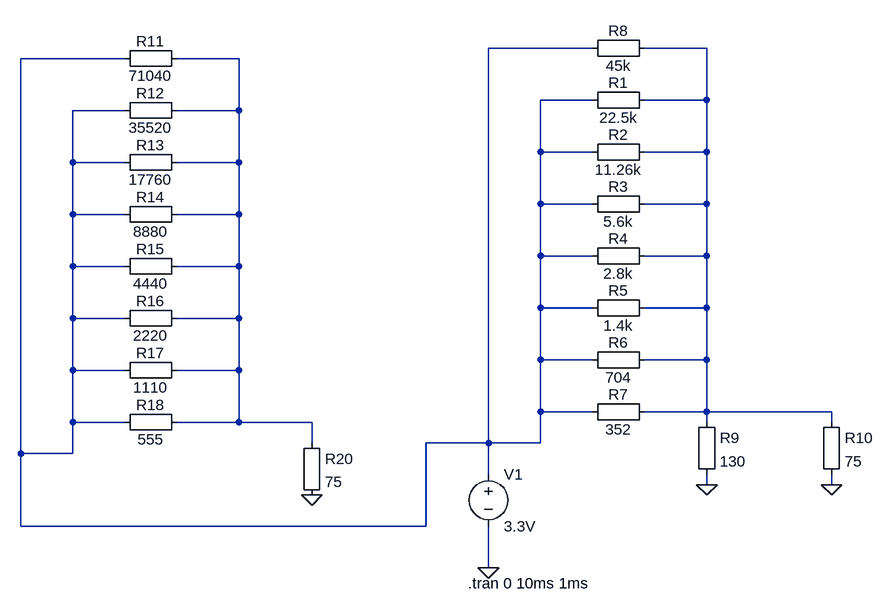
[diagram p0: schematic VGA_Widerstände.asc]
VGA_Widerstände.asc, the LTspice schematic file:
Version 4
SHEET 1 880 904
WIRE 128 64 -32 64
WIRE 304 64 208 64
WIRE -592 80 -752 80
WIRE -416 80 -512 80
WIRE 128 144 48 144
WIRE 304 144 304 64
WIRE 304 144 208 144
WIRE -592 160 -672 160
WIRE -416 160 -416 80
WIRE -416 160 -512 160
WIRE 48 224 48 144
WIRE 128 224 48 224
WIRE 304 224 304 144
WIRE 304 224 208 224
WIRE -672 240 -672 160
WIRE -592 240 -672 240
WIRE -416 240 -416 160
WIRE -416 240 -512 240
WIRE 48 304 48 224
WIRE 128 304 48 304
WIRE 304 304 304 224
WIRE 304 304 208 304
WIRE -672 320 -672 240
WIRE -592 320 -672 320
WIRE -416 320 -416 240
WIRE -416 320 -512 320
WIRE 48 384 48 304
WIRE 128 384 48 384
WIRE 304 384 304 304
WIRE 304 384 208 384
WIRE -672 400 -672 320
WIRE -592 400 -672 400
WIRE -416 400 -416 320
WIRE -416 400 -512 400
WIRE 48 464 48 384
WIRE 128 464 48 464
WIRE 304 464 304 384
WIRE 304 464 208 464
WIRE -672 480 -672 400
WIRE -592 480 -672 480
WIRE -416 480 -416 400
WIRE -416 480 -512 480
WIRE 48 544 48 464
WIRE 128 544 48 544
WIRE 304 544 304 464
WIRE 304 544 208 544
WIRE -672 560 -672 480
WIRE -592 560 -672 560
WIRE -416 560 -416 480
WIRE -416 560 -512 560
WIRE 48 624 48 544
WIRE 128 624 48 624
WIRE 304 624 304 544
WIRE 304 624 208 624
WIRE 496 624 304 624
WIRE -672 640 -672 560
WIRE -592 640 -672 640
WIRE -416 640 -416 560
WIRE -416 640 -512 640
WIRE -304 640 -416 640
WIRE 304 640 304 624
WIRE 496 640 496 624
WIRE -304 672 -304 640
WIRE -32 672 -32 64
WIRE -32 672 -128 672
WIRE 48 672 48 624
WIRE 48 672 -32 672
WIRE -752 688 -752 80
WIRE -672 688 -672 640
WIRE -672 688 -752 688
WIRE -32 720 -32 672
WIRE 304 736 304 720
WIRE 496 736 496 720
WIRE -752 800 -752 688
WIRE -128 800 -128 672
WIRE -128 800 -752 800
WIRE -32 864 -32 800
FLAG 304 736 0
FLAG -32 864 0
FLAG 496 736 0
FLAG -304 752 0
SYMBOL Misc\\EuropeanResistor 224 128 R90
WINDOW 0 5 56 VBottom 2
WINDOW 3 27 56 VTop 2
SYMATTR InstName R1
SYMATTR Value 22.5k
SYMBOL Misc\\EuropeanResistor 224 208 R90
WINDOW 0 5 56 VBottom 2
WINDOW 3 27 56 VTop 2
SYMATTR InstName R2
SYMATTR Value 11.26k
SYMBOL Misc\\EuropeanResistor 224 288 R90
WINDOW 0 5 56 VBottom 2
WINDOW 3 27 56 VTop 2
SYMATTR InstName R3
SYMATTR Value 5.6k
SYMBOL Misc\\EuropeanResistor 224 368 R90
WINDOW 0 5 56 VBottom 2
WINDOW 3 27 56 VTop 2
SYMATTR InstName R4
SYMATTR Value 2.8k
SYMBOL Misc\\EuropeanResistor 224 448 R90
WINDOW 0 5 56 VBottom 2
WINDOW 3 27 56 VTop 2
SYMATTR InstName R5
SYMATTR Value 1.4k
SYMBOL Misc\\EuropeanResistor 224 528 R90
WINDOW 0 5 56 VBottom 2
WINDOW 3 27 56 VTop 2
SYMATTR InstName R6
SYMATTR Value 704
SYMBOL Misc\\EuropeanResistor 224 608 R90
WINDOW 0 5 56 VBottom 2
WINDOW 3 27 56 VTop 2
SYMATTR InstName R7
SYMATTR Value 352
SYMBOL Misc\\EuropeanResistor 224 48 R90
WINDOW 0 5 56 VBottom 2
WINDOW 3 27 56 VTop 2
SYMATTR InstName R8
SYMATTR Value 45k
SYMBOL Misc\\EuropeanResistor 288 624 R0
SYMATTR InstName R9
SYMATTR Value 130
SYMBOL voltage -32 704 R0
WINDOW 123 0 0 Left 2
WINDOW 39 0 0 Left 2
SYMATTR InstName V1
SYMATTR Value 3.3V
SYMBOL Misc\\EuropeanResistor 480 624 R0
SYMATTR InstName R10
SYMATTR Value 75
SYMBOL Misc\\EuropeanResistor -496 64 R90
WINDOW 0 5 56 VBottom 2
WINDOW 3 27 56 VTop 2
SYMATTR InstName R11
SYMATTR Value 71040
SYMBOL Misc\\EuropeanResistor -496 144 R90
WINDOW 0 5 56 VBottom 2
WINDOW 3 27 56 VTop 2
SYMATTR InstName R12
SYMATTR Value 35520
SYMBOL Misc\\EuropeanResistor -496 224 R90
WINDOW 0 5 56 VBottom 2
WINDOW 3 27 56 VTop 2
SYMATTR InstName R13
SYMATTR Value 17760
SYMBOL Misc\\EuropeanResistor -496 304 R90
WINDOW 0 5 56 VBottom 2
WINDOW 3 27 56 VTop 2
SYMATTR InstName R14
SYMATTR Value 8880
SYMBOL Misc\\EuropeanResistor -496 384 R90
WINDOW 0 5 56 VBottom 2
WINDOW 3 27 56 VTop 2
SYMATTR InstName R15
SYMATTR Value 4440
SYMBOL Misc\\EuropeanResistor -496 464 R90
WINDOW 0 5 56 VBottom 2
WINDOW 3 27 56 VTop 2
SYMATTR InstName R16
SYMATTR Value 2220
SYMBOL Misc\\EuropeanResistor -496 544 R90
WINDOW 0 5 56 VBottom 2
WINDOW 3 27 56 VTop 2
SYMATTR InstName R17
SYMATTR Value 1110
SYMBOL Misc\\EuropeanResistor -496 624 R90
WINDOW 0 5 56 VBottom 2
WINDOW 3 27 56 VTop 2
SYMATTR InstName R18
SYMATTR Value 555
SYMBOL Misc\\EuropeanResistor -320 656 R0
SYMATTR InstName R20
SYMATTR Value 75
TEXT -64 888 Left 2 !.tran 0 10ms 1ms

The netlist it stands for:
* VGA_Widerstände.asc
R1 N002 N001 22.5k
R2 N002 N001 11.26k
R3 N002 N001 5.6k
R4 N002 N001 2.8k
R5 N002 N001 1.4k
R6 N002 N001 704
R7 N002 N001 352
R8 N002 N001 45k
R9 N002 0 130
V1 N001 0 3.3V
R10 N002 0 75
R11 N003 N001 71040
R12 N003 N001 35520
R13 N003 N001 17760
R14 N003 N001 8880
R15 N003 N001 4440
R16 N003 N001 2220
R17 N003 N001 1110
R18 N003 N001 555
R20 N003 0 75
.tran 0 10ms 1ms
.backanno
.end